# EasyEDA Pro project arsonBrush.eprj

# Schematic Schematic1
Board Name: Board1; Create Date: 2025-11-23; Page Name: P1; Project Name: arsonBrush; Schematic Name: Schematic1; Update Date: 2025-12-26; Company: EasyEDA.com; Page Size: A4; Version: V1.0
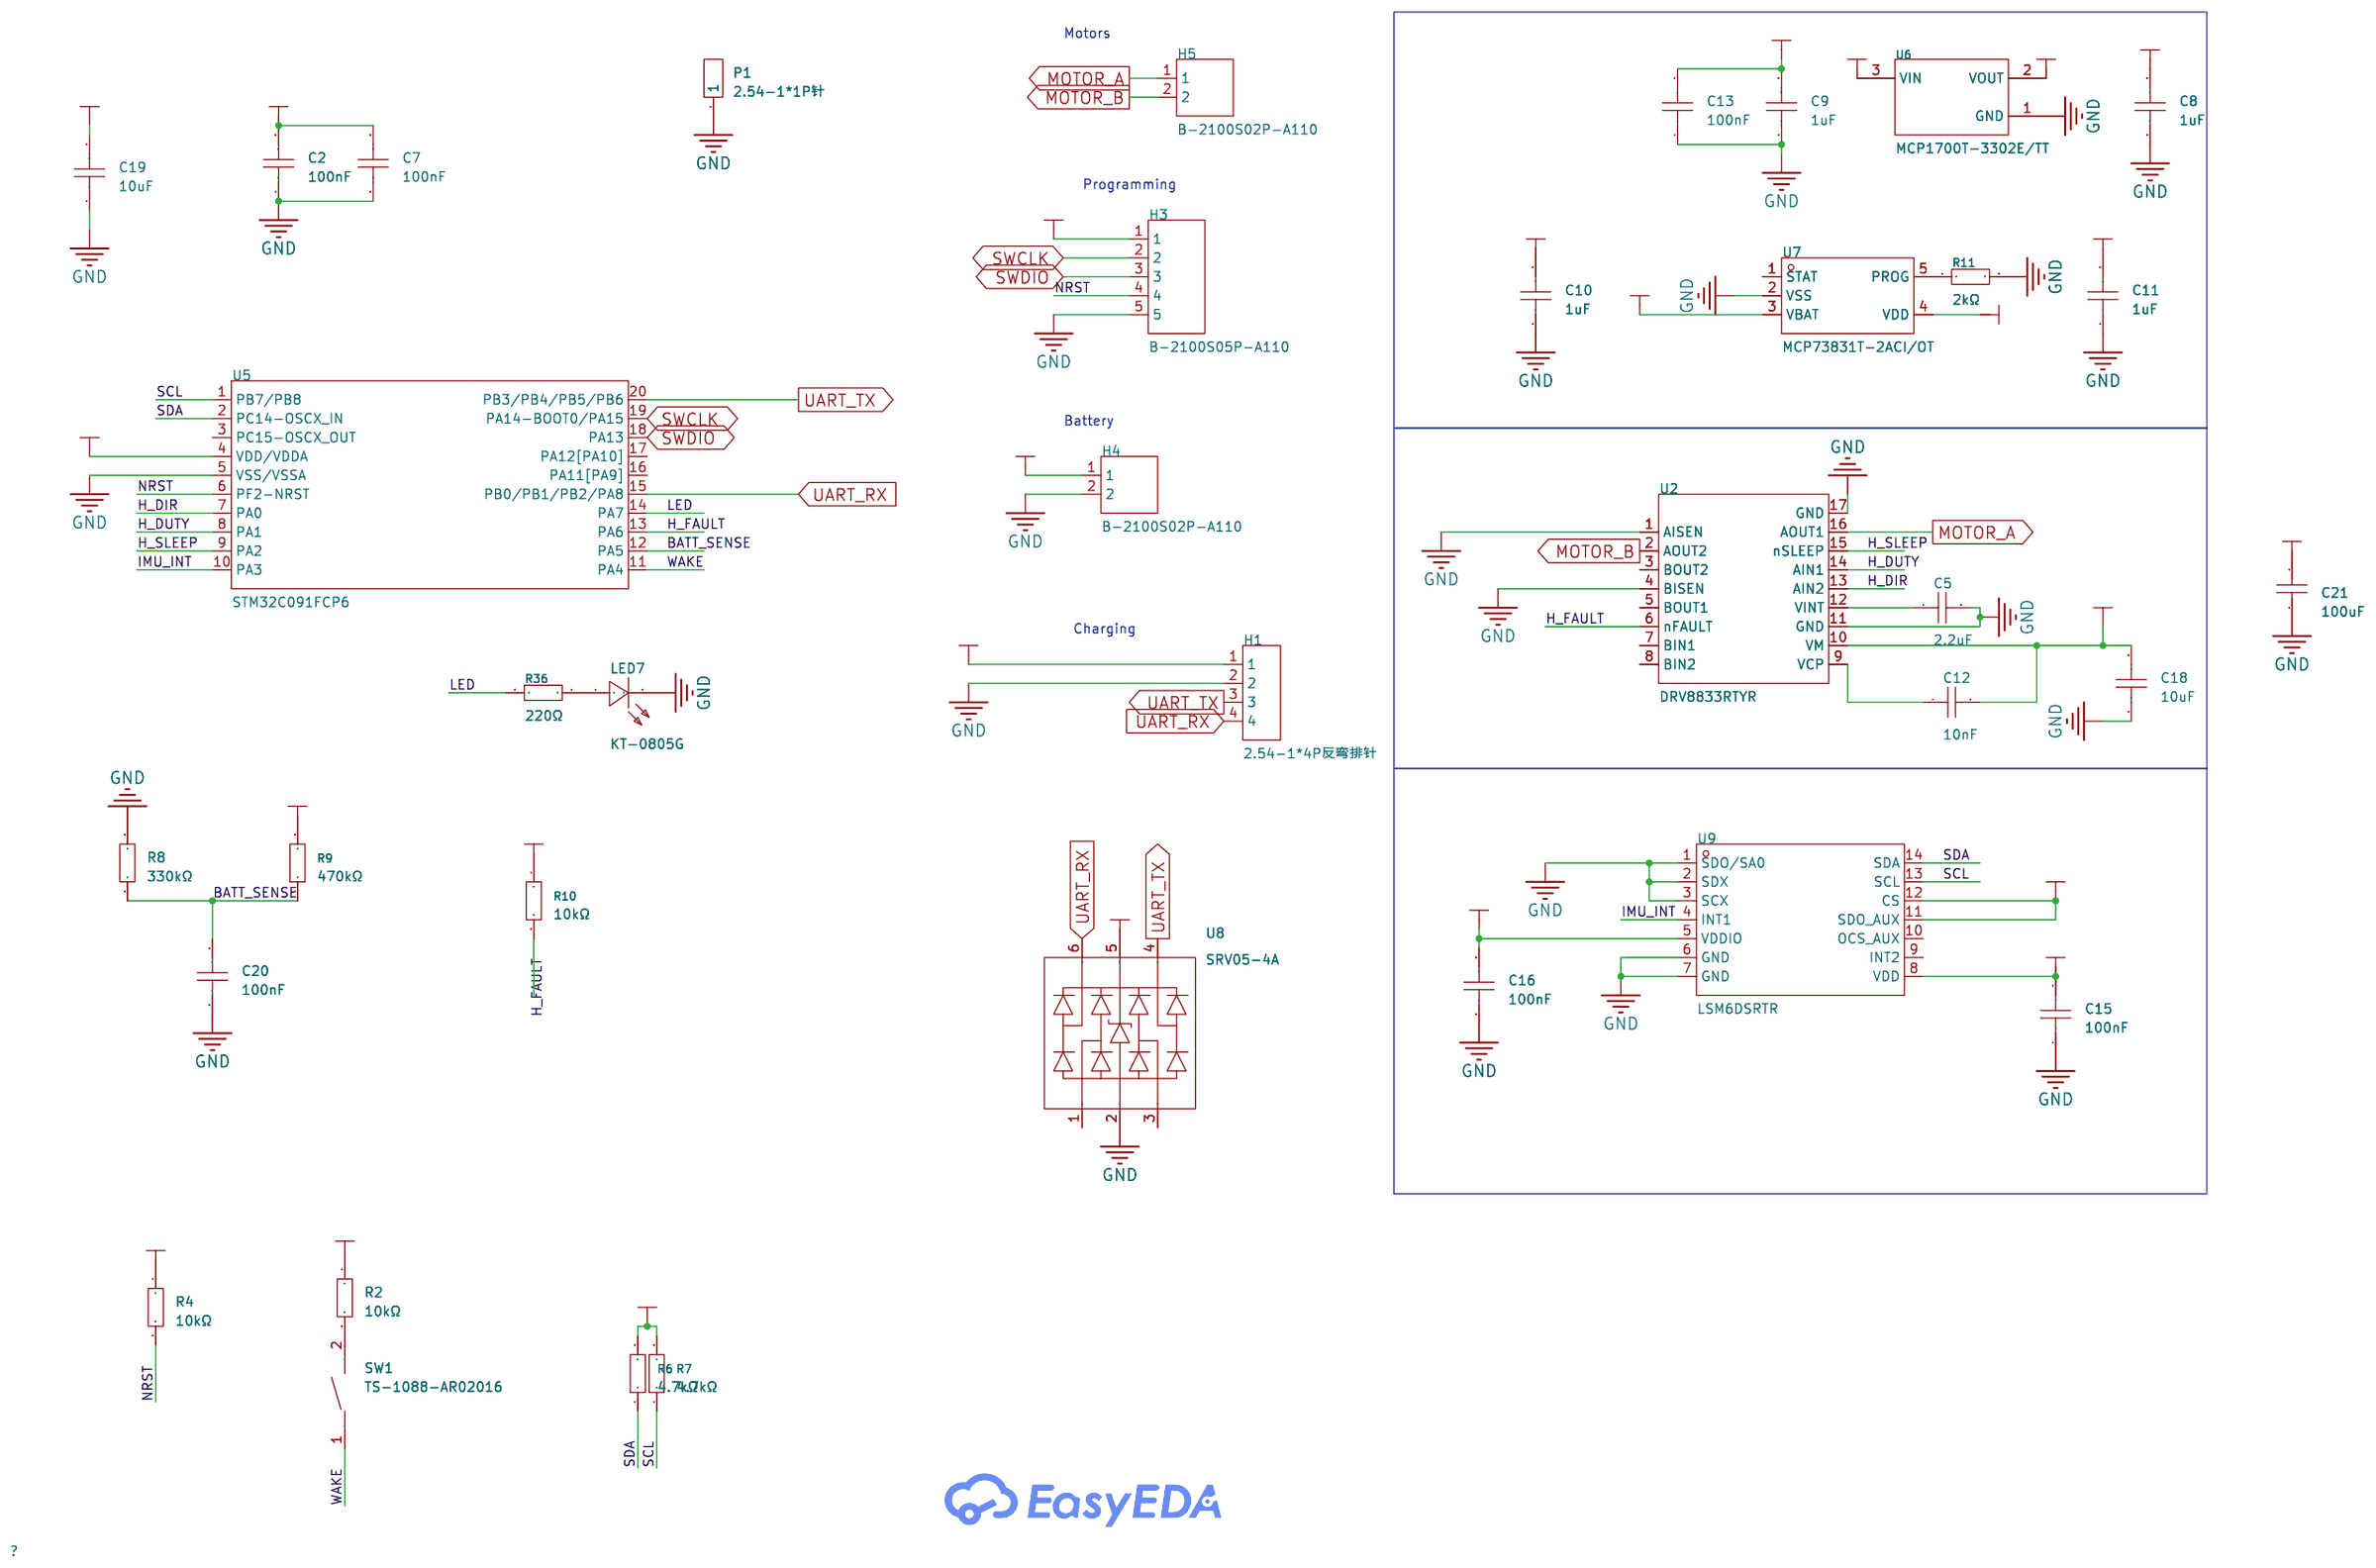
[diagram p0: schematic sheet]

## Parts
C2  100nF  [C0402]
C5  2.2uF  [C0603]
C7  100nF  [C0402]
C8  1uF  [C0603]
C9  1uF  [C0603]
C10  1uF  [C0603]
C11  1uF  [C0603]
C12  10nF  [C0402]
C13  100nF  [C0402]
C15  100nF  [C0402]
C16  100nF  [C0402]
C18  10uF  [C0805]
C19  10uF  [C0805]
C20  100nF  [C0402]
C21  100uF  [C1206]
H1  2.54-1*4P反弯排针  [HDR-TH_4P-P2.54-H-M-W10.4]  (no BOM)
H3  B-2100S05P-A110  [HDR-TH_5P-P2.54-V-M]  (no BOM)
H4  B-2100S02P-A110  [HDR-TH_2P-P2.54-V-M-1]  (no BOM)
H5  B-2100S02P-A110  [HDR-TH_2P-P2.54-V-M-1]  (no BOM)
LED7  KT-0805G  [LED0805-R-RD]
P1  2.54-1*1P针  [HDR-TH_1P-P2.54-V-M]  (no BOM)
R2  10kΩ  [R0402]
R4  10kΩ  [R0402]
R6  4.7kΩ  [R0402]
R7  4.7kΩ  [R0402]
R8  330kΩ  [R0603]
R9  470kΩ  [R0603]
R10  10kΩ  [R0402]
R11  2kΩ  [R0402]
R36  220Ω  [R0402]
SW1  TS-1088-AR02016  [SW-SMD_L3.9-W3.0-P4.45]
U2  DRV8833RTYR  [QFN-16_L4.0-W4.0-P0.65-TL-EP2.6]
U5  STM32C091FCP6  [TSSOP-20_L6.5-W4.4-P0.65-LS6.4-BL]
U6  MCP1700T-3302E/TT  [SOT-23-3_L2.9-W1.6-P1.90-LS2.8-BR]
U7  MCP73831T-2ACI/OT  [SOT-23-5_L3.0-W1.7-P0.95-LS2.8-BL]
U8  SRV05-4A  [SOT-23-6_L2.9-W1.6-P0.95-LS2.9-BL]
U9  LSM6DSRTR  [LGA-14_L3.0-W2.5-P0.50-BR]

## Library data of the parts
C2 C7 C13 C15 C16 C20 = CL05B104KO5NNNC: LCSC Part Name: 100nF ±10% 16V; Supplier Part: C1525; Manufacturer: SAMSUNG(三星); Supplier Footprint: 0402; JLCPCB Part Class: Basic Part; Datasheet: https://item.szlcsc.com/datasheet/CL05B104KO5NNNC/1877.html; Supplier: LCSC; Tolerance: ±10%; Voltage Rating: 16V; Temperature Coefficient: X7R
C5 = CL10A225KO8NNNC: LCSC Part Name: 2.2uF ±10% 16V; Supplier Part: C23630; Manufacturer: SAMSUNG(三星); Supplier Footprint: 0603; JLCPCB Part Class: Basic Part; Datasheet: https://item.szlcsc.com/datasheet/CL10A225KO8NNNC/24366.html; Supplier: LCSC; Tolerance: ±10%; Voltage Rating: 16V; Temperature Coefficient: X5R
C8-C11 = CL10A105KB8NNNC: LCSC Part Name: 1uF ±10% 50V; Supplier Part: C15849; Manufacturer: SAMSUNG(三星); Supplier Footprint: 0603; JLCPCB Part Class: Basic Part; Datasheet: https://item.szlcsc.com/datasheet/CL10A105KB8NNNC/16531.html; Supplier: LCSC; Tolerance: ±10%; Voltage Rating: 50V; Temperature Coefficient: X5R
C12 = CL05B103KB5NNNC: LCSC Part Name: 10nF ±10% 50V; Supplier Part: C15195; Manufacturer: SAMSUNG(三星); Supplier Footprint: 0402; JLCPCB Part Class: Basic Part; Datasheet: https://item.szlcsc.com/datasheet/CL05B103KB5NNNC/15869.html; Supplier: LCSC; Tolerance: ±10%; Voltage Rating: 50V; Temperature Coefficient: X7R
C18 C19 = CL21A106KAYNNNE_C15850: LCSC Part Name: 10uF ±10% 25V; Supplier Part: C15850; Manufacturer: SAMSUNG(三星); Manufacturer Part: CL21A106KAYNNNE; Supplier Footprint: 0805; JLCPCB Part Class: Basic Part; Datasheet: https://item.szlcsc.com/datasheet/CL21A106KAYNNNE/16532.html; Supplier: LCSC; Tolerance: ±10%; Voltage Rating: 25V; Temperature Coefficient: X5R
C21 = CL31A107MQHNNNE: LCSC Part Name: 100uF ±20% 6.3V; Supplier Part: C15008; Manufacturer: SAMSUNG(三星); Supplier Footprint: 1206; JLCPCB Part Class: Basic Part; Datasheet: https://item.szlcsc.com/datasheet/CL31A107MQHNNNE/15681.html; Supplier: LCSC; Tolerance: ±20%; Voltage Rating: 6.3V; Temperature Coefficient: X5R
H1 = 2.54-1*4P反弯排针: LCSC Part Name: 1x4P 间距:2.54mm 方针 弯插; Supplier Part: C91552; Manufacturer: BOOMELE(博穆精密); Supplier Footprint: 弯插,P=2.54mm; JLCPCB Part Class: Extended Part; Datasheet: https://item.szlcsc.com/datasheet/2.54-1*4P%25E5%258F%258D%25E5%25BC%25AF%25E6%258E%2592%25E9%2592%2588/92741.html; Supplier: LCSC; Pin Structure: 1x4P; Pitch: 2.54mm; Circluar Pins/Square Pins: Pin Header; Mounting Type: Right Angle; Number of Rows: 1; Number of Pins: 4P; Current Rating: 3A; Length of Mating Pin: 6mm; Contact Material: Brass; Contact Plating: Gold; Operating Temperature: -55℃~+105℃; Color: Black
H3 = B-2100S05P-A110: LCSC Part Name: 1x5P 间距:2.54mm 直插; Supplier Part: C124379; Manufacturer: Ckmtw(灿科盟); Supplier Footprint: 插件,P=2.54mm; JLCPCB Part Class: Extended Part; Datasheet: https://item.szlcsc.com/datasheet/B-2100S05P-A110/125654.html; Supplier: LCSC; Pin Structure: 1x5P; Pitch: 2.54mm; Mounting Type: Through Hole; Number of Rows: 1; Number of Pins: 5P; Length of Mating Pin: 6mm; Insulation Height: 2.54mm; Length of End Connection Pin: 3mm; Contact Material: Brass; Operating Temperature: -40℃~+105℃; Color: Black
H4 H5 = B-2100S02P-A110: LCSC Part Name: 1x2P 间距:2.54mm 直插; Supplier Part: C124375; Manufacturer: Ckmtw(灿科盟); Supplier Footprint: 插件,P=2.54mm; JLCPCB Part Class: Extended Part; Datasheet: https://item.szlcsc.com/datasheet/B-2100S02P-A110/125650.html; Supplier: LCSC; Pin Structure: 1x2P; Pitch: 2.54mm; Mounting Type: Through Hole; Number of Rows: 1; Number of Pins: 2P; Length of Mating Pin: 6mm; Insulation Height: 2.54mm; Length of End Connection Pin: 3mm; Contact Material: Brass; Operating Temperature: -40℃~+105℃; Color: Black
LED7 = KT-0805G: Lamp Holder Type:- Illumination Color:Emerald Green Voltage - Forward(Vf):2.6V~3.1V Voltage - Forward(Vf):2.6V~3.1V Power(Watts):100mW Forward Current:5mA Wavelength - Dominant:513nm~528nm Wavelength - Dominant:513nm~528nm Peak Wavelength:525nm Diode Conf; LCSC Part Name: 0805 翠绿 高亮; Supplier Part: C2297; Manufacturer: KENTO; Supplier Footprint: 0805; JLCPCB Part Class: Basic Part; Datasheet: https://item.szlcsc.com/datasheet/KT-0805G/2670.html; Supplier: LCSC; Illumination Color: Emerald Green; Voltage - Forward(Vf): 2.6V~3.1V; Power(Watts): 100mW; Forward Current: 5mA; Wavelength - Dominant: 513nm~528nm; Peak Wavelength: 525nm; Luminous Intensity: 430mcd; Viewing Angle: 120°; Operating Temperature: -40℃~+85℃
P1 = 2.54-1*1P针: LCSC Part Name: 方针 直插; Supplier Part: C81276; Manufacturer: BOOMELE(博穆精密); Supplier Footprint: 插件,P=2.54mm; JLCPCB Part Class: Extended Part; Datasheet: https://item.szlcsc.com/datasheet/2.54-1*1P%25E9%2592%2588/82426.html; Supplier: LCSC; Circluar Pins/Square Pins: Pin Header; Mounting Type: Through Hole; Number of Rows: 1; Number of Pins: 1P; Current Rating: 3A; Length of Mating Pin: 6mm; Insulation Height: 2.5mm; Length of End Connection Pin: 3mm; Contact Material: Brass; Contact Plating: Gold; Operating Temperature: -55℃~+105℃; Color: Black
R2 R4 = 0402WGF1002TCE: LCSC Part Name: 10kΩ ±1% 62.5mW 厚膜电阻; Supplier Part: C25744; Manufacturer: UNI-ROYAL(厚声); Supplier Footprint: 0402; JLCPCB Part Class: Basic Part; Datasheet: https://item.szlcsc.com/datasheet/0402WGF1002TCE/26487.html; Supplier: LCSC; Type: Thick Film Resistor; Tolerance: ±1%; Power(Watts): 62.5mW; Voltage-Supply(Max): 50V; Temperature Coefficient: ±100ppm/℃; Operating Temperature: -55℃~+155℃
R6 R7 = 0402WGF4701TCE: LCSC Part Name: 4.7kΩ ±1% 62.5mW 厚膜电阻; Supplier Part: C25900; Manufacturer: UNI-ROYAL(厚声); Supplier Footprint: 0402; JLCPCB Part Class: Basic Part; Datasheet: https://item.szlcsc.com/datasheet/0402WGF4701TCE/26643.html; Supplier: LCSC; Type: Thick Film Resistor; Tolerance: ±1%; Power(Watts): 62.5mW; Voltage-Supply(Max): 50V; Temperature Coefficient: ±100ppm/℃; Operating Temperature: -55℃~+155℃
R8 = 0603WAF3303T5E: LCSC Part Name: 330kΩ ±1% 100mW 厚膜电阻; Supplier Part: C23137; Manufacturer: UNI-ROYAL(厚声); Supplier Footprint: 0603; JLCPCB Part Class: Basic Part; Datasheet: https://atta.szlcsc.com/upload/public/pdf/source/20200306/C422600_1E6D84923E4A46A82E41ADD87F860B5C.pdf; Supplier: LCSC; Type: Thick Film Resistors; Tolerance: ±1%; Temperature Coefficient: ±100ppm/℃; Operating Temperature Range: -55℃~+155℃
R9 = 0603WAF4703T5E: LCSC Part Name: 470kΩ ±1% 100mW 厚膜电阻; Supplier Part: C23178; Manufacturer: UNI-ROYAL(厚声); Supplier Footprint: 0603; JLCPCB Part Class: Basic Part; Datasheet: https://item.szlcsc.com/datasheet/0603WAF4703T5E/23905.html; Supplier: LCSC; Type: Thick Film Resistor; Tolerance: ±1%; Power(Watts): 100mW; Voltage-Supply(Max): 75V; Temperature Coefficient: ±100ppm/℃; Operating Temperature: -55℃~+155℃
R10 = 0402WGJ0103TCE: LCSC Part Name: 10kΩ ±5% 62.5mW 厚膜电阻; Supplier Part: C25531; Manufacturer: UNI-ROYAL(厚声); Supplier Footprint: 0402; JLCPCB Part Class: Extended Part; Datasheet: https://item.szlcsc.com/datasheet/0402WGJ0103TCE/26274.html; Supplier: LCSC; Type: Thick Film Resistor; Tolerance: ±5%; Power(Watts): 62.5mW; Voltage-Supply(Max): 50V; Temperature Coefficient: ±100ppm/℃; Operating Temperature: -55℃~+155℃
R11 = 0402WGF2001TCE: LCSC Part Name: 2kΩ ±1% 62.5mW 厚膜电阻; Supplier Part: C4109; Manufacturer: UNI-ROYAL(厚声); Supplier Footprint: 0402; JLCPCB Part Class: Basic Part; Datasheet: https://atta.szlcsc.com/upload/public/pdf/source/20200306/C422600_1E6D84923E4A46A82E41ADD87F860B5C.pdf; Supplier: LCSC; Type: Thick Film Resistors; Tolerance: ±1%; Temperature Coefficient: ±100ppm/℃; Operating Temperature Range: -55℃~+155℃
R36 = 0402WGF2200TCE: Type:Thick Film Resistor Resistance:220Ω Tolerance:±1% Tolerance:±1% Power(Watts):62.5mW Voltage-Supply(Max):50V Temperature Coefficient:±100ppm/℃ Temperature Coefficient:±100ppm/℃ Operating Temperature:-55℃~+155℃ Operating Temperature:-55℃~+155℃; LCSC Part Name: 220Ω ±1% 62.5mW 厚膜电阻; Supplier Part: C25091; Manufacturer: UNI-ROYAL(厚声); Supplier Footprint: 0402; JLCPCB Part Class: Basic Part; Datasheet: https://item.szlcsc.com/datasheet/0402WGF2200TCE/25834.html; Supplier: LCSC; Type: Thick Film Resistor; Tolerance: ±1%; Power(Watts): 62.5mW; Voltage-Supply(Max): 50V; Temperature Coefficient: ±100ppm/℃; Operating Temperature: -55℃~+155℃
SW1 = TS-1088-AR02016: Circuit:SPST Actuator Style:Round Button Operating Force:1.6N Mounting Type:Surface Mount,Vertical Length:4mm Width:3mm Switch Height:2mm with Bracket:Without Bracket Contact Current:50mA Voltage Rating:12V Actuator/Cap Color:Black Termination Style:SMD(S; LCSC Part Name: 4*3*2mm 立贴 轻触开关; Supplier Part: C720477; Manufacturer: XUNPU(讯普); Supplier Footprint: SMD; JLCPCB Part Class: Basic Part; Datasheet: https://item.szlcsc.com/datasheet/TS-1088-AR02016/763484.html; Supplier: LCSC; Circuit: SPST; Actuator Style: Round Button; Operating Force: 1.6N; Mounting Type: Surface Mount,Vertical; Length: 4mm; Width: 3mm; Switch Height: 2mm; with Bracket: Without Bracket; Contact Current: 50mA; Voltage Rating: 12V; Actuator/Cap Color: Black; Termination Style: SMD(SMT) Tab; Life: 100,000 Cycles; Operating Temperature: -30℃~+80℃
U2 = DRV8833RTYR: LCSC Part Name: 1.5A 有刷直流电机驱动芯片 10.8V; Supplier Part: C154936; Manufacturer: TI(德州仪器); Supplier Footprint: QFN-16-EP(4x4); JLCPCB Part Class: Extended Part; Datasheet: https://www.ti.com/cn/lit/gpn/drv8833; Supplier: LCSC
U5 = STM32C091FCP6: Supplier Part: C45338507; JLCPCB Part Class: Extended Part; Supplier: LCSC
U6 = MCP1700T-3302E/TT: LCSC Part Name: 输入6V 输出3.3V 250mA; Supplier Part: C39051; Manufacturer: MICROCHIP(美国微芯); Supplier Footprint: SOT-23; JLCPCB Part Class: Extended Part; Datasheet: https://item.szlcsc.com/datasheet/MCP1700T-3302E%252FTT/40034.html; Supplier: LCSC; Output Type: Fixed; Voltage - Supply: 6V; Output Voltage: 3.3V; Output Current: 250mA; Power Supply Rejection Ratio (PSRR): 44dB@(100Hz); Voltage Dropout: 178mV@(250mA); standby current: 1.6uA; Features: Short Circuit Protection；Over Temperature Protection; Operating Temperature: -40℃~+125℃@(Tj); Output Configuration: Positive; Number of Outputs: 1
U7 = MCP73831T-2ACI/OT: LCSC Part Name: 单节全集成锂离子/锂聚合物充电管理控制器; Supplier Part: C424093; Manufacturer: MICROCHIP(美国微芯); Supplier Footprint: SOT-23-5; JLCPCB Part Class: Extended Part; Datasheet: https://item.szlcsc.com/datasheet/MCP73831T-2ACI%252FOT/417116.html; Supplier: LCSC; The Chip Type: Charging IC; Voltage - Supply: 3.75V~6V; Charge Current - Max: 550mA; Charging Saturation Voltage: 4.2V; Type of Battery: Lithium Battery; Number of Cells: 1; Operating Temperature: -40℃~+85℃; Supply Current (Iq): 53uA
U8 = SRV05-4A_C20615829: LCSC Part Name: 丝印:V05 单向ESD 5V截止 峰值浪涌电流：4A@8/20us; Supplier Part: C20615829; Manufacturer: R+O(宏嘉诚); Supplier Footprint: SOT-23-6L; JLCPCB Part Class: Extended Part; Datasheet: https://item.szlcsc.com/datasheet/SRV05-4A/21980004.html; Supplier: LCSC; Polarity: Unidirectional; Reverse Stand-Off Voltage (Vrwm): 5V; Clamping Voltage: 15V; Peak Pulse Current (Ipp): 4A@8/20us; Peak Pulse Power Dissipation (Ppp): 80W@8/20us; Voltage - Breakdown: 6V; Reverse Leakage Current (Ir): 5uA; Operating Temperature: -55℃~+155℃; level of protection: IEC 61000-4-5；IEC 61000-4-2; Type: ESD; Junction Capacitance: 0.5pF；1pF
U9 = LSM6DSRTR: Supplier Part: C784817; Manufacturer: ST(意法半导体); Supplier Footprint: LGA-14(2.5x3); JLCPCB Part Class: Extended Part; Datasheet: https://item.szlcsc.com/datasheet/LSM6DSRTR/840864.html; Supplier: LCSC; Sensor Type: Accelerometer Gyroscope; Operating Temperature: -40℃~+85℃

## Nets
3V3: C2.2 C7.2 C8.2 C15.2 C16.2 C19.2 H3.1 R2.1 R4.1 R6.2 R7.2 R10.1 U5.4(VDD/VDDA) U6.2(VOUT) U9.5(VDDIO) U9.8(VDD) U9.11(SDO_AUX) U9.12(CS)
GND: C2.1 C5.2 C7.1 C8.1 C9.1 C10.1 C11.1 C13.1 C15.1 C16.1 C18.1 C19.1 C20.1 C21.1 H1.2 H3.5 H4.2 LED7.2(K) P1.1 R8.2 R11.2 U2.1(AISEN) U2.4(BISEN) U2.11(GND) U2.17(GND) U5.5(VSS/VSSA) U6.1(GND) U7.2(VSS) U8.2(VN) U9.1(SDO/SA0) U9.2(SDX) U9.3(SCX) U9.6(GND) U9.7(GND)
VBAT: C9.2 C10.2 C12.2 C13.2 C18.2 C21.2 H4.1 R9.2 U2.10(VM) U6.3(VIN) U7.3(VBAT)
VIN: C11.2 H1.1 U7.4(VDD) U8.5(VP)
BATT_SENSE: C20.2 R8.1 R9.1 U5.12(PA5)
H_DIR: U2.13(AIN2) U5.7(PA0)
H_DUTY: U2.14(AIN1) U5.8(PA1)
H_FAULT: R10.2 U2.6(nFAULT) U5.13(PA6)
H_SLEEP: U2.15(nSLEEP) U5.9(PA2)
IMU_INT: U5.10(PA3) U9.4(INT1)
LED: R36.2 U5.14(PA7)
MOTOR_A: H5.1 U2.16(AOUT1)
MOTOR_B: H5.2 U2.2(AOUT2)
NRST: H3.4 R4.2 U5.6(PF2-NRST)
SCL: R7.1 U5.1(PB7/PB8) U9.13(SCL)
SDA: R6.1 U5.2(PC14-OSCX_IN) U9.14(SDA)
SWCLK: H3.2 U5.19(PA14-BOOT0/PA15)
SWDIO: H3.3 U5.18(PA13)
UART_RX: H1.4 U5.15(PB0/PB1/PB2/PA8) U8.6(I/O)
UART_TX: H1.3 U5.20(PB3/PB4/PB5/PB6) U8.4(I/O)
WAKE: SW1.1 U5.11(PA4)
$1N2142: R2.2 SW1.2
$1N2994: C5.1 U2.12(VINT)
$1N3528: C12.1 U2.9(VCP)
$1N13306: R11.1 U7.5(PROG)
$1N17887: LED7.1(A) R36.1

Not connected (* = marked no-connect by the designer): U2 3(BOUT2) 5(BOUT1) 7(BIN1) 8(BIN2); U5 3(PC15-OSCX_OUT) 16(PA11[PA9]) 17(PA12[PA10]); U7 1(STAT); U8 1(I/O) 3(I/O); U9 9(INT2) 10(OCS_AUX)

## Notes on the sheet
- Motors
- Programming
- Battery
- Charging

# Schematic Schematic2
Board Name: Board2; Create Date: 2025-11-30; Page Name: P1; Project Name: arsonBrush; Schematic Name: Schematic2; Update Date: 2025-12-21; Company: EasyEDA.com; Page Size: A4; Version: V1.0
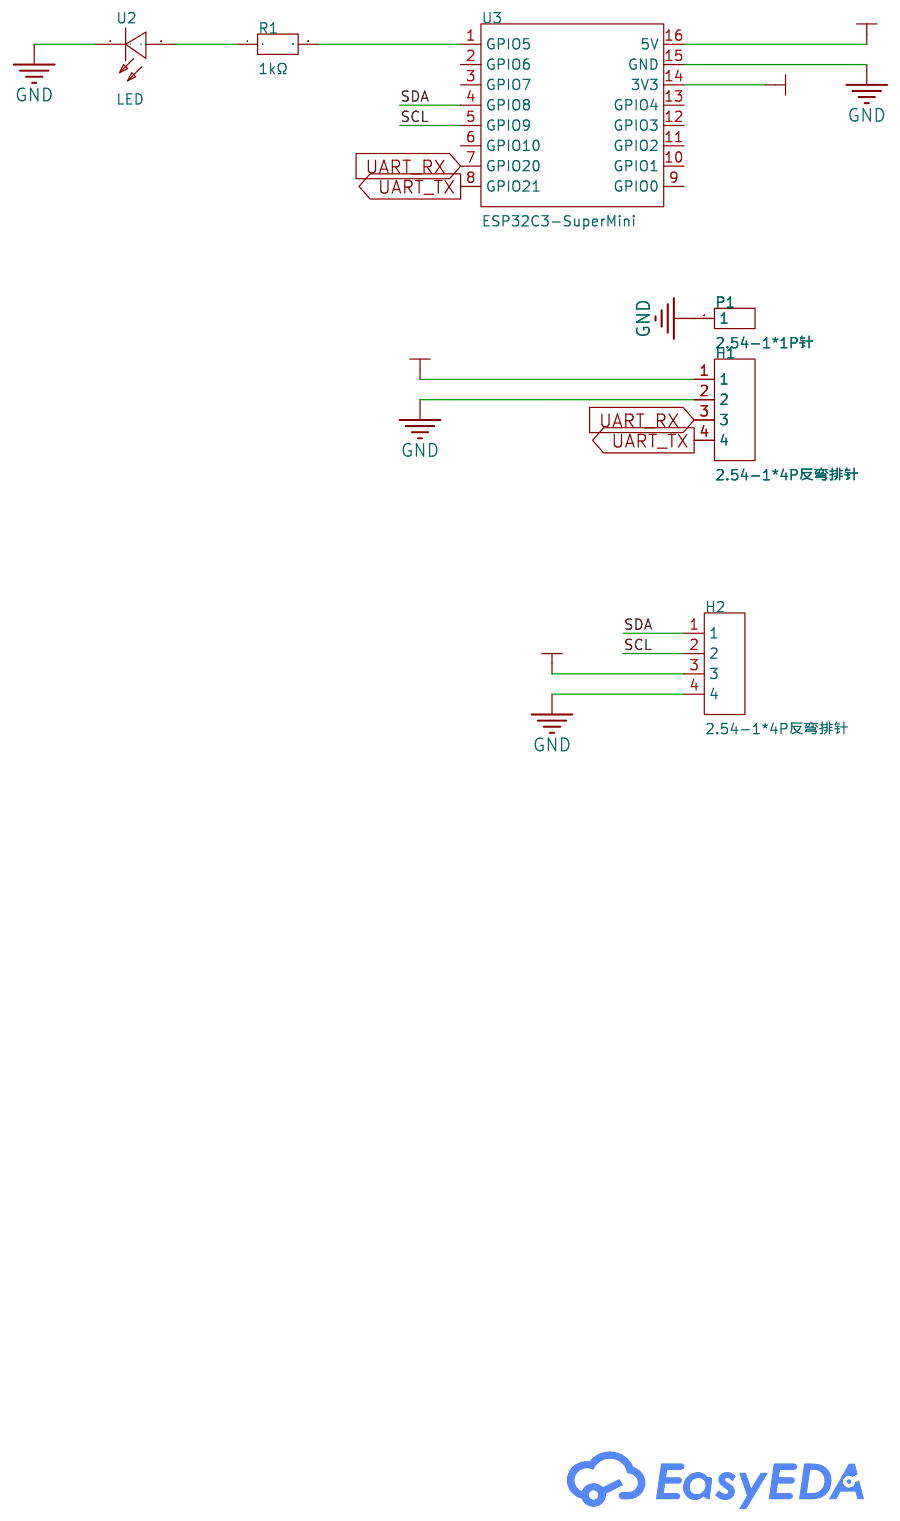
[diagram p1: schematic sheet]

## Parts
H1  2.54-1*4P反弯排针  [HDR-TH_4P-P2.54-H-M-W10.4]  (no BOM)
H2  2.54-1*4P反弯排针  [HDR-TH_4P-P2.54-H-M-W10.4]  (no BOM)
P1  2.54-1*1P针  [HDR-TH_1P-P2.54-V-M]  (no BOM)
R1  1kΩ  [RES-TH_BD2.3-L6.5-P10.50-D0.5]
U2  LED  [LED-TH_BD4.0-P2.54-FD_RED]
U3  ESP32C3-SuperMini  [COMM-SMD_16P-L22.5-W18.0-P2.54-TL]

## Library data of the parts
H1 H2 = 2.54-1*4P反弯排针: LCSC Part Name: 1x4P 间距:2.54mm 方针 弯插; Supplier Part: C91552; Manufacturer: BOOMELE(博穆精密); Supplier Footprint: 弯插,P=2.54mm; JLCPCB Part Class: Extended Part; Datasheet: https://item.szlcsc.com/datasheet/2.54-1*4P%25E5%258F%258D%25E5%25BC%25AF%25E6%258E%2592%25E9%2592%2588/92741.html; Supplier: LCSC; Pin Structure: 1x4P; Pitch: 2.54mm; Circluar Pins/Square Pins: Pin Header; Mounting Type: Right Angle; Number of Rows: 1; Number of Pins: 4P; Current Rating: 3A; Length of Mating Pin: 6mm; Contact Material: Brass; Contact Plating: Gold; Operating Temperature: -55℃~+105℃; Color: Black
P1 = 2.54-1*1P针: LCSC Part Name: 方针 直插; Supplier Part: C81276; Manufacturer: BOOMELE(博穆精密); Supplier Footprint: 插件,P=2.54mm; JLCPCB Part Class: Extended Part; Datasheet: https://item.szlcsc.com/datasheet/2.54-1*1P%25E9%2592%2588/82426.html; Supplier: LCSC; Circluar Pins/Square Pins: Pin Header; Mounting Type: Through Hole; Number of Rows: 1; Number of Pins: 1P; Current Rating: 3A; Length of Mating Pin: 6mm; Insulation Height: 2.5mm; Length of End Connection Pin: 3mm; Contact Material: Brass; Contact Plating: Gold; Operating Temperature: -55℃~+105℃; Color: Black
R1 = MF1/4W-1KΩ±1%T52: LCSC Part Name: 金属膜电阻 1kΩ ±1% 250mW; Supplier Part: C713997; Manufacturer: 华星机电; Supplier Footprint: 插件,D2.3xL6.5mm; JLCPCB Part Class: Extended Part; Datasheet: https://atta.szlcsc.com/upload/public/pdf/source/20200731/C713882_AE8EB1102749D7E4FB4FB13DC898C429.pdf; Supplier: LCSC; Type: Metal Film Resistors; Tolerance: ±1%; Power(Watts): 250mW; Temperature Coefficient: ±200ppm/℃
U2 = LED: Supplier Part: C9900015665; Supplier Footprint: SIP-2P; JLCPCB Part Class: Extended Part; Supplier: LCSC
U3 = ESP32C3-SuperMini: Supplier Part: C9900147397; Supplier Footprint: SMD-16P; JLCPCB Part Class: Extended Part; Supplier: LCSC

## Nets
3V3: H2.3 U3.14(3V3)
GND: H1.2 H2.4 P1.1 U2.2(-) U3.15(GND)
SCL: H2.2 U3.5(GPIO9)
SDA: H2.1 U3.4(GPIO8)
UART_RX: H1.3 U3.7(GPIO20)
UART_TX: H1.4 U3.8(GPIO21)
VOUT: H1.1 U3.16(5V)
$1N739: R1.1 U2.1(+)
$1N1757: R1.2 U3.1(GPIO5)

Not connected (* = marked no-connect by the designer): U3 2(GPIO6) 3(GPIO7) 6(GPIO10) 9(GPIO0) 10(GPIO1) 11(GPIO2) 12(GPIO3) 13(GPIO4)

# Board PCB1
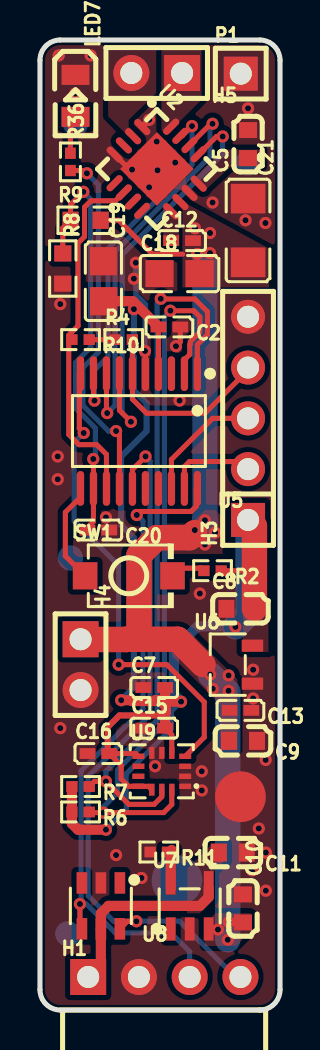
[diagram p2: board, top side]
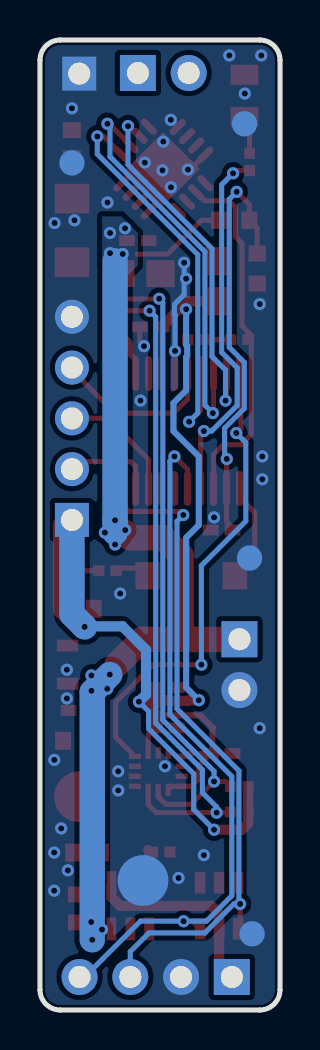
[diagram p3: board, bottom side, seen from below]

Outline 12.01 x 48.51 mm; copper layers: Top Layer, Bottom Layer. Coordinates in mm from the lower left corner of the outline.
Outline path: 0,47.5 0,1.02 arc(0.3,0.3) 1.02,0 11,0 arc(11.72,0.3) 12.01,1.02 12.01,47.5 arc(11.72,48.22) 11,48.51 1.02,48.51 arc(0.3,48.22) 0,47.5
Stack: Top Layer 0.035mm / Dielectric1 1.51mm FR4 er 4.5 / Bottom Layer 0.035mm

## Design rules (mm)
template: Custom Config
spacing copperThickness1oz (default): track to track 0.102, other pairs 0.152 to 0.3
spacing copperThickness2oz: track to track 0.203, other pairs 0.152 to 0.3
track width copperThickness1oz (default): min 0.127, default 0.254, max 2.54
track width copperThickness2oz: min 0.203, default 0.254, max 2.54
differential pair differentialPair (default): width min 0.127, default 0.254, max 2.54; gap min 0.152, default 0.152
via viaSize (default): diameter min 0.5, default 0.61, max 10; hole min 0.3, default 0.305, max 6.3

## Placement (name value [footprint] x y rotation side)
C2  100nF  [C0402]  6.48 34.16 180 top
C5  2.2uF  [C0603]  10.41 43.31 90 top
C7  100nF  [C0402]  5.72 16.13 0 top
C8  1uF  [C0603]  10.03 20.07 0 top
C9  1uF  [C0603]  10.16 13.46 180 top
C10  1uF  [C0603]  10.16 5.08 270 top
C11  1uF  [C0603]  9.65 7.87 180 top
C12  10nF  [C0402]  7.11 38.48 0 top
C13  100nF  [C0402]  10.03 14.99 180 top
C15  100nF  [C0402]  5.72 14.1 0 top
C16  100nF  [C0402]  2.92 12.83 0 top
C18  10uF  [C0805]  6.99 36.83 0 top
C19  10uF  [C0805]  3.18 36.45 270 top
C20  100nF  [C0402]  2.92 24 180 top
C21  100uF  [C1206]  10.41 38.99 270 top
H1  2.54-1*4P反弯排针  [HDR-TH_4P-P2.54-H-M-W10.4]  6.22 1.65 0 top
H3  B-2100S05P-A110  [HDR-TH_5P-P2.54-V-M]  10.41 29.59 90 top
H4  B-2100S02P-A110  [HDR-TH_2P-P2.54-V-M-1]  2.03 17.27 270 top
H5  B-2100S02P-A110  [HDR-TH_2P-P2.54-V-M-1]  5.84 46.86 180 top
LED7  KT-0805G  [LED0805-R-RD]  1.78 45.72 270 top
NOREF  -  [Pad_e192]  10.41 42.37 0 top
NOREF#2  -  [Pad_e366]  1.78 44.32 0 top
NOREF#3  -  [Pad_e115]  1.52 22.61 0 top
NOREF#4  -  [Pad_e172]  6.86 6.48 0 top
NOREF#5  -  [Pad_e474]  10.03 10.67 0 top
NOREF#6  -  [Pad_e173]  1.4 3.81 0 top
P1  2.54-1*1P针  [HDR-TH_1P-P2.54-V-M]  10.05 46.83 0 top
R2  10kΩ  [R0402]  8.64 21.97 180 top
R4  10kΩ  [R0402]  4.19 33.53 0 top
R6  4.7kΩ  [R0402]  2.03 9.91 180 top
R7  4.7kΩ  [R0402]  2.03 11.18 180 top
R8  330kΩ  [R0603]  1.14 37.08 270 top
R9  470kΩ  [R0603]  2.29 39.5 0 top
R10  10kΩ  [R0402]  2.03 33.53 180 top
R11  2kΩ  [R0402]  5.95 7.9 180 top
R36  220Ω  [R0402]  1.52 42.42 270 top
SW1  TS-1088-AR02016  [SW-SMD_L3.9-W3.0-P4.45]  4.44 21.72 0 top
U2  DRV8833RTYR  [QFN-16_L4.0-W4.0-P0.65-TL-EP2.6]  5.85 42.06 315 top
U5  STM32C091FCP6  [TSSOP-20_L6.5-W4.4-P0.65-LS6.4-BL]  4.95 28.96 180 top
U6  MCP1700T-3302E/TT  [SOT-23-3_L2.9-W1.6-P1.90-LS2.8-BR]  9.4 17.27 0 top
U7  MCP73831T-2ACI/OT  [SOT-23-5_L3.0-W1.7-P0.95-LS2.8-BL]  7.49 5.21 0 top
U8  SRV05-4A  [SOT-23-6_L2.9-W1.6-P0.95-LS2.9-BL]  3.05 5.21 180 top
U9  LSM6DSRTR  [LGA-14_L3.0-W2.5-P0.50-BR]  6.1 11.94 0 top

## Footprints (pads in the part's own frame, mm; a bottom-side part is the same pattern mirrored in y, then rotated)
C0402
  rect 0.79x0.54 smd: 1(-0.545,0) 2(0.545,0)
C0603
  rect 0.8x0.9 smd: 1(-0.7,0) 2(0.7,0)
C0805
  rect 1.41x1.35 smd: 1(-1,0) 2(1,0)
C1206
  rect 1.485x1.728 smd: 1(-1.593,0) 2(1.593,0)
HDR-TH_1P-P2.54-V-M
  rect 1.7x1.7 hole 1.1: 1(0,0)
HDR-TH_2P-P2.54-V-M-1
  rect 1.8x1.8 hole 1.1: 1(-1.27,0)
  round 1.8 hole 1.1: 2(1.27,0)
HDR-TH_4P-P2.54-H-M-W10.4
  rect 1.8x1.8 hole 1.1: 1(-3.81,0)
  round 1.8 hole 1.1: 2(-1.27,0) 3(1.27,0) 4(3.81,0)
HDR-TH_5P-P2.54-V-M
  rect 1.7x1.7 hole 1.1: 1(-5.08,0)
  round 1.7 hole 1.1: 2(-2.54,0) 3(0,0) 4(2.54,0) 5(5.08,0)
LED0805-R-RD
  rect 1x1.399 smd: 1(1.05,0) 2(-1.05,0)
LGA-14_L3.0-W2.5-P0.50-BR
  rect 0.6x0.27 smd: 1(1.17,-0.75) 2(1.17,-0.25) 3(1.17,0.25) 4(1.17,0.75) 8(-1.17,0.75) 9(-1.17,0.25) 10(-1.17,-0.25) 11(-1.17,-0.75)
  rect 0.27x0.6 smd: 5(0.5,0.92) 6(0,0.92) 7(-0.5,0.92) 12(-0.5,-0.92) 13(0,-0.92) 14(0.5,-0.92)
Pad_e115
  round 1.27 smd far side: TP2(0,0)
Pad_e172
  round 2.54 smd far side: TP2(0,0)
Pad_e173
  round 1.27 smd far side: TP2(0,0)
Pad_e192
  round 1.27 smd far side: TP2(0,0)
Pad_e366
  round 1.27 smd far side: TP2(0,0)
Pad_e474
  round 2.54 smd: TP1(0,0)
QFN-16_L4.0-W4.0-P0.65-TL-EP2.6
  oval 1x0.35 smd: 1(-2,0.965) 2(-2,0.315) 3(-2,-0.336) 4(-2,-0.986) 9(2,-0.991) 10(2,-0.34) 11(2,0.31) 12(2,0.96)
  oval 0.35x1 smd: 5(-0.991,-2) 6(-0.34,-2) 7(0.31,-2) 8(0.96,-2) 13(0.96,2) 14(0.31,2) 15(-0.34,2) 16(-0.991,2)
  rect 2.6x2.6 smd: 17(0,0)
R0402
  rect 0.566x0.54 smd: 1(-0.433,0) 2(0.433,0)
R0603
  rect 0.806x0.864 smd: 1(-0.753,0) 2(0.753,0)
SOT-23-3_L2.9-W1.6-P1.90-LS2.8-BR
  rect 1.07x0.6 smd: 1(1.235,-0.95) 2(1.235,0.95) 3(-1.235,0)
SOT-23-5_L3.0-W1.7-P0.95-LS2.8-BL
  rect 0.49x1.157 smd: 1(-0.95,-1.153) 2(0,-1.153) 3(0.95,-1.153)
  rect 0.49x1.175 smd: 4(0.95,1.153) 5(-0.95,1.153)
SOT-23-6_L2.9-W1.6-P0.95-LS2.9-BL
  rect 0.532x1.072 smd: 1(-0.95,-1.149) 2(0,-1.149) 3(0.95,-1.149) 4(0.95,1.149) 5(0,1.149) 6(-0.95,1.149)
SW-SMD_L3.9-W3.0-P4.45
  rect 1.23x1.36 smd: 1(-2.185,0) 2(2.185,0)
TSSOP-20_L6.5-W4.4-P0.65-LS6.4-BL
  oval 0.364x1.742 smd: 1(-2.925,-2.871) 2(-2.275,-2.871) 3(-1.625,-2.871) 4(-0.975,-2.871) 5(-0.325,-2.871) 6(0.325,-2.871) 7(0.975,-2.871) 8(1.625,-2.871) 9(2.275,-2.871) 10(2.925,-2.871) 11(2.925,2.871) 12(2.275,2.871) 13(1.625,2.871) 14(0.975,2.871) 15(0.325,2.871) 16(-0.325,2.871) 17(-0.975,2.871) 18(-1.625,2.871) 19(-2.275,2.871) 20(-2.925,2.871)

## Nets
As in the schematic, except:
GND: C2.1 C5.2 C7.1 C8.1 C9.1 C10.1 C11.1 C13.1 C15.1 C16.1 C18.1 C19.1 C20.1 C21.1 H1.2 H3.5 H4.2 LED7.2 NOREF.TP2 NOREF#2.TP2 NOREF#3.TP2 NOREF#4.TP2 NOREF#5.TP1 NOREF#6.TP2 P1.1 R8.2 R11.2 U2.1 U2.4 U2.11 U2.17 U5.5 U6.1 U7.2 U8.2 U9.1 U9.2 U9.3 U9.6 U9.7

Pads without a net: U2 3 5 7 8; U5 3 16 17; U7 1; U8 1 3; U9 9 10

## Via types
v1: diameter 0.61, hole 0.305, Top Layer to Bottom Layer, 76 vias

## Routing (per net, layer and track width the routed paths; a pad name or vN(x,y) marks a point on that pad's centre or on a via; arc(x,y) is an arc through that point)
3V3: length 73.5
  Top Layer w0.254: U9.5 6.6,13.76 C15.2 ; U5.4 5.93,31.83 C2.2 ; U9.12 5.43,11.19 U9.11 4.43,11.19 4.06,11.56 4.06,12.23 C16.2 ; 10.73,21.97 R2.1 ; U9.8 4.79,12.83 3.52,12.83 ; 2.34,33.53 3.63,33.53
  Top Layer w0.305: 3.52,12.83 3.39,12.95 3.39,14.05 3.34,14.1 3.97,14.73 6.26,14.73
  Top Layer w0.508: C7.2 6.26,15.46 6.3,15.42 ; 6.3,15.42 v1(7.06,15.42) ; 6.3,15.42 6.3,15.2 ; 6.3,15.2 6.01,15.49 5.77,15.49 5.73,15.45 4.61,15.45 4.57,15.49 v1(4.06,15.49) ; 6.3,15.2 6.3,14.9 6.26,14.86 C15.2 ; R7.2 R6.2 1.6,9.32 1.91,9.02 v1(3.3,9.02) ; C19.2 4.65,35.45 C2.2
  Top Layer w1.27: C8.2 10.73,24.19 H3.1
  Bottom Layer w0.254: v1(3.3,9.02) 4.32,10.03 4.32,11.81 6.58,14.07 6.58,14.94 v1(7.06,15.42)
  Bottom Layer w0.305: v1(4.7,35.05) 4.7,33.27 4.65,33.21 4.65,32.71 4.7,32.65 4.7,30.99 5.33,30.35 5.33,28.96 4.06,27.69 4.06,24.26 4.7,23.62 4.7,16.13 v1(4.06,15.49)
  Bottom Layer w0.508: 9.81,19.19 7.89,19.19 6.71,18.01 6.71,15.78 v1(7.06,15.42)
  Bottom Layer w1.27: v1(9.78,19.16) 9.81,19.19 10.41,19.8 H3.1
GND: length 8.5
  Top Layer w0.254: U2.4 4.49,42.03 v1(4.61,42.03) ; v1(5.26,32.96) 5.28,32.94 U5.5 ; v1(6.81,33.2) 7.01,33.4 7.01,33.42 7.02,33.43 C2.1
  Top Layer w0.305: U2.1 5.47,44.51 v1(5.47,44.52)
  Bottom Layer w0.254: v1(4.8,37.38) 4.8,35.78 5.28,35.29 5.28,34.81 5.26,34.78 v1(5.26,32.96)
  vias: v1(0.94,47.74) v1(0.89,27.69) v1(0.89,26.54) v1(1.02,35.31) v1(1.02,14.1) v1(1.76,45.84) v1(2.54,47.74) v1(3.3,24.64) v1(3.81,7.75) v1(4.7,36.58) v1(5.08,6.6) v1(5.46,41.15) v1(5.76,12.19) v1(5.84,43.43) v1(5.88,42) v1(6.77,42.38) v1(6.99,30.48) v1(8,20.83) v1(8.1,11.94) v1(8.1,10.98) v1(8.64,40.39) v1(10.29,39.5) v1(10.41,45.1) v1(10.67,17.02) v1(10.67,15.58) v1(10.62,6.98) v1(10.95,9.08) v1(11.28,39.36) v1(11.3,12.51) v1(11.3,7.87) v1(11.3,5.97)
VBAT: length 46.2
  Top Layer w0.254: 7.15,37.8 5.63,37.8 3.94,39.5 R9.2
  Top Layer w1.27: 4.95,18.54 4.32,18.54 4.32,18.53 2.04,18.53 H4.1 ; 4.95,18.54 4.95,22.73 5.84,23.62 7.49,23.62 7.75,23.88 ; 4.95,18.54 6.89,18.54 8.16,17.27
  Bottom Layer w1.27: v1(9.4,3.51) 9.4,15.9 v1(8.52,16.78) ; 8.25,37.47 v1(8.25,24.49) 8.25,23.88
  vias: v1(7.76,39.1) v1(7.75,24) v1(7.87,37.81) v1(8.25,23.28) v1(8.51,38.86) v1(8.51,37.86) v1(8.65,16.06) v1(8.76,23.88) v1(8.91,4.02) v1(9.44,16.73) v1(9.44,15.96) v1(9.45,4.4)
VIN: length 9.6
  Top Layer w0.508: H1.1 3.05,2.29 U8.5 3.05,4.83 3.43,5.21 8,5.21 8.44,5.65 8.44,6.11
BATT_SENSE: length 21.6
  Top Layer w0.254: v1(2.67,27.56) 2.68,27.55 U5.12 2.68,24.43 2.25,24 ; R8.1 1.14,39.11 R9.1 1.53,40.28 v1(2.17,40.92)
  Bottom Layer w0.254: v1(2.17,40.92) 2.54,40.55 2.54,33.14 1.79,32.39 1.79,30.09 2.77,29.1 2.77,27.59 2.74,27.56 v1(2.67,27.56)
H_DIR: length 20.7
  Top Layer w0.254: v1(4.55,29.42) 3.98,29.99 U5.7 ; v1(9.14,43.69) 8.83,43.69 7.94,42.8
  Bottom Layer w0.254: v1(4.55,29.42) 4.12,29.86 4.12,37.78 9.14,42.81 v1(9.14,43.69)
H_DUTY: length 20.2
  Top Layer w0.254: U5.8 3.33,29.89 v1(3.36,29.85) ; 7.48,43.26 8.55,44.32 v1(8.64,44.32)
  Bottom Layer w0.254: v1(3.36,29.85) 3.76,30.25 3.76,37.93 8.51,42.68 8.51,44.2 v1(8.64,44.32)
H_FAULT: length 18
  Top Layer w0.254: U2.6 3.78,40.47 2.55,40.47 2.23,40.15 2.23,38.68 1.91,38.35 1.91,34.22 1.44,33.75 1.44,28.78 1.95,28.27 2.84,28.27 3.33,27.79 U5.13
H_SLEEP: length 17.9
  Top Layer w0.254: v1(2.73,30.48) 2.68,30.53 U5.9 ; U2.15 7.12,43.72 v1(7.61,44.21)
  Bottom Layer w0.254: v1(2.73,30.48) 2.73,32 3.4,32.68 3.4,38.08 7.61,42.28 v1(7.61,44.21)
IMU_INT: length 24
  Top Layer w0.254: v1(2.19,28.86) 1.97,29.08 1.97,31.77 U5.10 ; U9.4 8.22,13.64 8.22,15.4 6.35,17.27 v1(3.94,17.27)
  Bottom Layer w0.254: v1(3.94,17.27) 3.94,22.23 1.71,24.45 1.71,28.38 v1(2.19,28.86)
LED: length 18.2
  Top Layer w0.254: v1(3.81,28.96) 3.98,28.79 U5.14 ; v1(2.35,41.85) 2.21,41.98 R36.2
  Bottom Layer w0.254: v1(3.81,28.96) 3.42,28.96 2.14,30.23 2.14,32.12 2.92,32.89 2.92,41.28 v1(2.35,41.85)
NRST: length 10.3
  Top Layer w0.254: 4.63,33.4 4.5,33.53 ; 4.63,33.4 4.63,31.95 ; 4.63,33.4 4.63,33.52 ; 10.41,32.26 10.41,32 8.25,29.84 5.33,29.84 4.63,30.55 U5.6
SCL: length 35.9
  Top Layer w0.254: v1(6.05,35.57) 6.06,35.56 7.75,35.56 8.38,34.92 8.38,33.78 7.88,33.28 U5.1 ; U9.13 6.1,10.67 5.72,10.29 4.44,10.29 v1(3.3,11.43) 2.72,11.43 R7.1
  Bottom Layer w0.254: v1(3.3,11.43) 3.3,11.94 5.87,14.5 5.87,35.39 v1(6.05,35.57)
SDA: length 36.3
  Top Layer w0.254: v1(6.53,34.97) 7.7,34.97 8,34.67 8,33.9 7.52,33.43 7.52,33.3 7.49,33.27 7.49,32.78 7.23,32.52 U5.2 ; U9.14 6.6,10.28 6.19,9.87 v1(3.18,9.87) 2.5,9.87 R6.1
  Bottom Layer w0.254: v1(3.18,9.87) 3.18,10.16 3.89,10.87 3.89,12.01 6.22,14.35 6.22,34.67 v1(6.53,34.97)
SWCLK: length 4.5
  Top Layer w0.254: U5.19 7.23,27.18 7.48,27.43 10.16,27.43 10.41,27.18
SWDIO: length 6.2
  Top Layer w0.254: U5.18 6.58,27.53 8.64,29.59 10.29,29.59 10.41,29.72
UART_RX: length 35.5
  Top Layer w0.254: U5.15 4.63,27.03 v1(5.28,27.69) ; U8.6 4.38,4.44 v1(4.83,4.44)
  Bottom Layer w0.254: v1(5.28,27.69) 5.51,27.46 5.51,14.78 2.41,11.68 2.41,5.72 3.68,4.45 4.82,4.45 v1(4.83,4.44) 4.83,4.45 6.99,4.45 9.78,1.65 H1.4
UART_TX: length 34
  Top Layer w0.254: v1(2,5.3) 2,4.16 U8.4 ; U5.20 7.82,26.02 7.82,25.19 7.56,24.94 5.02,24.94 v1(4.84,24.76)
  Bottom Layer w0.254: v1(4.84,24.76) 5.16,24.45 5.16,15.06 2.06,11.96 2.06,5.36 v1(2,5.3) 2.32,5.3 3.77,3.86 6.56,3.86 7.49,2.92 7.49,1.65
WAKE: length 5.1
  Top Layer w0.254: SW1.1 1.27,22.71 1.27,24.89 2.03,25.65 U5.11
$1N2142: length 1.6
  Top Layer w0.254: R2.2 8.08,22.1 6.63,22.1
$1N13306: length 1.9
  Top Layer w0.508: 6.54,6.11 6.54,7.95 6.6,8
$1N17887: length 1.9
  Top Layer w0.254: LED7.1 1.52,44.42 R36.1

## Copper pours and planes (outline as drawn; the poured copper is in the pictures)
3V3 on Top Layer: 2.5,36.16 3.93,36.16 3.93,33.28 2.5,33.28
3V3 on Top Layer: 10.16,20.52 11.43,20.52 11.43,17.91 10.16,17.91
GND on Top Layer: -1.14,49.91 13.59,49.91 13.59,-8 -1.14,-8
GND on Bottom Layer: -1.14,50.04 15.56,50.04 15.56,-8 -1.14,-8
VBAT on Top Layer: 8.25,4.84 10.54,4.84 10.54,3.2 8.25,3.2
VBAT on Top Layer: 6.6,18.92 9.88,18.92 9.88,13.01 6.6,13.01
VBAT on Top Layer: 7.13,40.3 11.51,40.3 11.51,36.14 7.13,36.14
VBAT on Top Layer: 6.35,25.02 9.14,25.02 9.14,22.81 6.35,22.81
VBAT on Bottom Layer: 7.11,39.7 8.9,39.7 8.9,36.58 7.11,36.58
VIN on Top Layer: 7.37,8.27 9.27,8.27 9.27,4.84 7.37,4.84
MOTOR_A on Top Layer: 6.08,48.06 8.09,48.06 8.09,43.75 6.08,43.75
MOTOR_B on Top Layer: 3.41,48 5.81,48 5.81,43.7 3.41,43.7
$1N2994 on Top Layer: 7.71,43.03 11.12,43.03 11.12,41.02 7.71,41.02
$1N3528 on Top Layer: 6.17,40.2 6.97,40.2 6.97,38.23 6.17,38.23

# Board PCB2
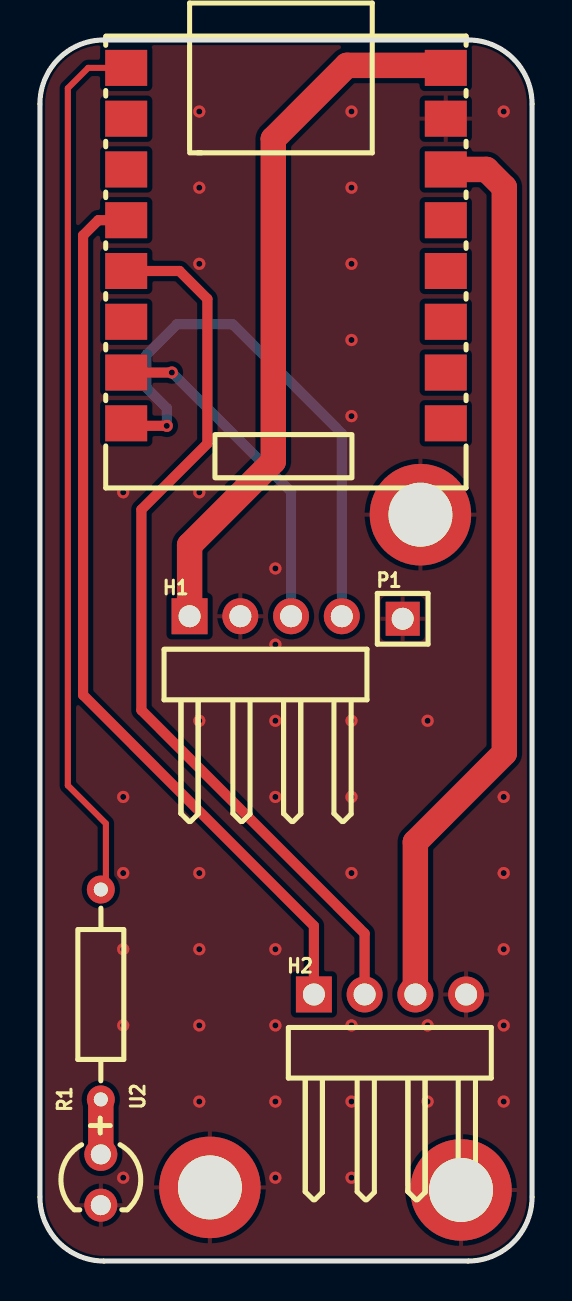
[diagram p4: board, top side]
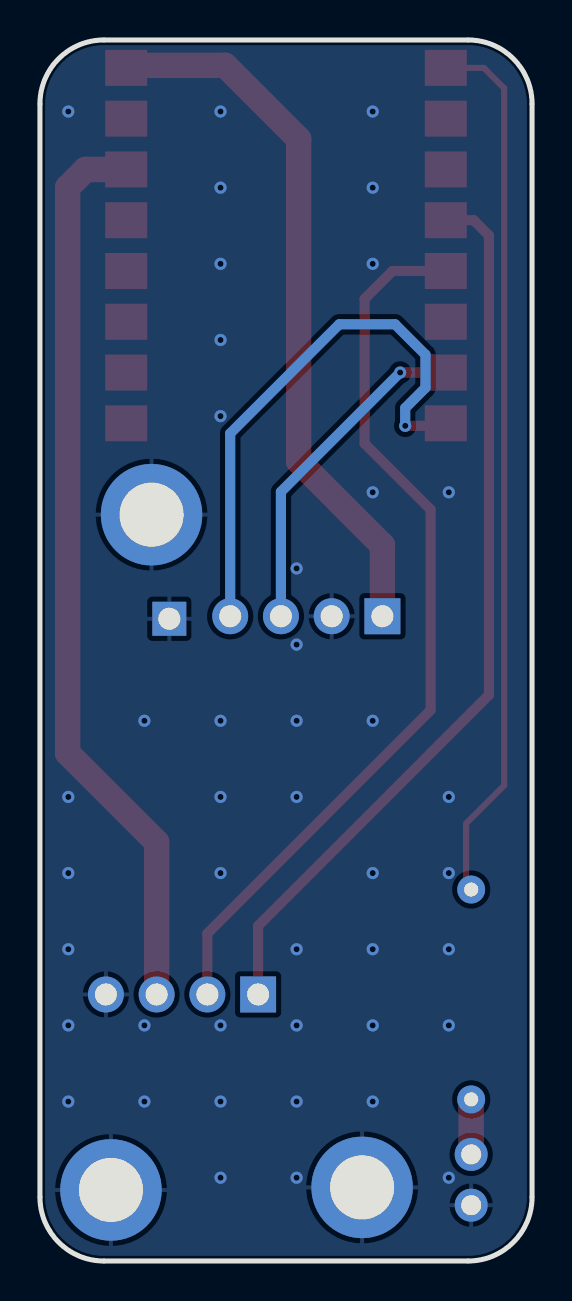
[diagram p5: board, bottom side, seen from below]

Outline 24.64 x 61.09 mm; copper layers: Top Layer, Bottom Layer. Coordinates in mm from the lower left corner of the outline.
Outline path: 0,57.89 0,3.2 arc(0.94,0.94) 3.2,0 21.44,0 arc(23.7,0.94) 24.64,3.2 24.64,57.89 arc(23.7,60.15) 21.44,61.09 3.2,61.09 arc(0.94,60.15) 0,57.89
Stack: Top Layer 0.035mm / Dielectric1 1.51mm FR4 er 4.5 / Bottom Layer 0.035mm

## Design rules (mm)
template: JLCPCB Capability(Two Layers Board)
spacing copperThickness1oz (default): track to track 0.102, other pairs 0.152 to 0.3
spacing copperThickness2oz: track to track 0.203, other pairs 0.152 to 0.3
track width copperThickness1oz (default): min 0.127, default 0.254, max 2.54
track width copperThickness2oz: min 0.203, default 0.254, max 2.54
differential pair differentialPair (default): width min 0.127, default 0.254, max 2.54; gap min 0.152, default 0.152
via viaSize (default): diameter min 0.5, default 0.61, max 10; hole min 0.3, default 0.305, max 6.3

## Placement (name value [footprint] x y rotation side)
H1  2.54-1*4P反弯排针  [HDR-TH_4P-P2.54-H-M-W10.4]  11.3 32.26 0 top
H2  2.54-1*4P反弯排针  [HDR-TH_4P-P2.54-H-M-W10.4]  17.53 13.33 0 top
NOREF  -  [Pad_e782]  19.05 37.34 0 top
NOREF#2  -  [Pad_e779]  21.08 3.56 0 top
NOREF#3  -  [Pad_e781]  8.51 3.68 0 top
P1  2.54-1*1P针  [HDR-TH_1P-P2.54-V-M]  18.16 32.13 0 top
R1  1kΩ  [RES-TH_BD2.3-L6.5-P10.50-D0.5]  3.05 13.33 90 top
U2  LED  [LED-TH_BD4.0-P2.54-FD_RED]  3.05 4.06 270 top
U3  ESP32C3-SuperMini  [COMM-SMD_16P-L22.5-W18.0-P2.54-TL]  12.32 50.8 0 top

## Footprints (pads in the part's own frame, mm; a bottom-side part is the same pattern mirrored in y, then rotated)
COMM-SMD_16P-L22.5-W18.0-P2.54-TL
  rect 2.102x1.802 smd: 1(-8.001,8.89) 2(-8.001,6.35) 3(-8.001,3.81) 4(-8.001,1.27) 5(-8.001,-1.27) 6(-8.001,-3.81) 7(-8.001,-6.35) 8(-8.001,-8.89) 9(8.001,-8.89) 10(8.001,-6.35) 11(8.001,-3.81) 12(8.001,-1.27) 13(8.001,1.27) 14(8.001,3.81) 15(8.001,6.35) 16(8.001,8.89)
HDR-TH_1P-P2.54-V-M
  rect 1.7x1.7 hole 1.1: 1(0,0)
HDR-TH_4P-P2.54-H-M-W10.4
  rect 1.8x1.8 hole 1.1: 1(-3.81,0)
  round 1.8 hole 1.1: 2(-1.27,0) 3(1.27,0) 4(3.81,0)
LED-TH_BD4.0-P2.54-FD_RED
  round 1.651 hole 1: 1(-1.27,0) 2(1.27,0)
Pad_e779
  round 5.08 hole 3.2: 1(0,0)
Pad_e781
  round 5.08 hole 3.2: 1(0,0)
Pad_e782
  round 5.08 hole 3.2: 1(0,0)
RES-TH_BD2.3-L6.5-P10.50-D0.5
  round 1.4 hole 0.7: 1(-5.25,0) 2(5.25,0)

## Nets
As in the schematic, except:
GND: H1.2 H2.4 NOREF.1 NOREF#2.1 NOREF#3.1 P1.1 U2.2 U3.15

Pads without a net: U3 2 3 6 9 10 11 12 13

## Via types
v1: diameter 0.61, hole 0.305, Top Layer to Bottom Layer, 45 vias

## Routing (per net, layer and track width the routed paths; a pad name or vN(x,y) marks a point on that pad's centre or on a via; arc(x,y) is an arc through that point)
3V3: length 45.5
  Top Layer w1.27: U3.14 22.35,54.61 23.25,53.71 23.25,25.41 18.8,20.95 H2.3
GND:
  vias: v1(4.17,38.46) v1(4.17,23.22) v1(4.17,19.41) v1(4.17,15.6) v1(4.17,11.79) v1(4.17,4.17) v1(7.98,57.51) v1(7.98,53.7) v1(7.98,49.89) v1(7.98,38.46) v1(7.98,27.03) v1(7.98,19.41) v1(7.98,15.6) v1(7.98,11.79) v1(7.98,7.98) v1(11.79,34.65) v1(11.79,30.84) v1(11.79,27.03) v1(11.79,23.22) v1(11.79,15.6) v1(11.79,11.79) v1(11.79,7.98) v1(11.79,4.17) v1(15.6,57.51) v1(15.6,53.7) v1(15.6,49.89) v1(15.6,46.08) v1(15.6,42.27) v1(15.6,27.03) v1(15.6,23.22) v1(15.6,19.41) v1(15.6,11.79) v1(15.6,7.98) v1(15.6,4.17) v1(19.41,27.03) v1(19.41,11.79) v1(19.41,7.98) v1(23.22,57.51) v1(23.22,23.22) v1(23.22,19.41) v1(23.22,15.6) v1(23.22,11.79) v1(23.22,7.98)
SCL: length 45.4
  Top Layer w0.508: H2.2 16.26,16.38 5.08,27.56 5.08,37.59 8.38,40.89 8.38,48.13 6.98,49.53 U3.5
SDA: length 45.2
  Top Layer w0.508: U3.4 2.92,52.07 2.16,51.31 2.16,28.32 13.72,16.76 H2.1
UART_RX: length 17
  Top Layer w0.508: U3.7 v1(6.6,44.45)
  Bottom Layer w0.508: H1.3 12.57,38.48 v1(6.6,44.45)
UART_TX: length 27.9
  Top Layer w0.508: v1(6.35,41.78) 4.44,41.78 U3.8
  Bottom Layer w0.508: v1(6.35,41.78) 6.35,42.67 5.33,43.69 5.33,45.34 6.86,46.86 9.65,46.86 15.11,41.4 H1.4
VOUT: length 35.8
  Top Layer w1.27: H1.1 7.49,35.81 11.68,40 11.68,56.13 15.37,59.82 20.19,59.82 U3.16
$1N739: length 2.8
  Top Layer w1.27: U2.1 R1.1
$1N1757: length 44.2
  Top Layer w0.305: U3.1 2.41,59.69 1.4,58.67 1.4,23.79 3.3,21.89 3.3,18.58

## Copper pours and planes (outline as drawn; the poured copper is in the pictures)
GND on Top Layer: -0.89,62.23 26.92,62.23 26.92,-1.4 -0.89,-1.4
GND on Bottom Layer: -1.91,63.25 27.3,63.25 27.3,-2.92 -1.91,-2.92
